# Altium schematic sheet IMU.SchDoc
size A4
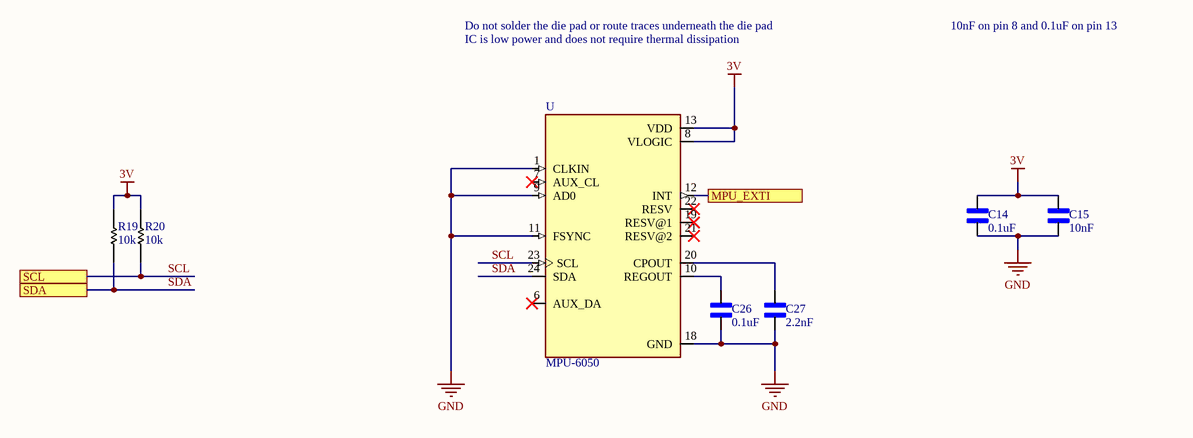
[diagram p0: IMU.SchDoc]

## Parts
C14  0.1uF  [0402 Capacitor Generic]
C15  10nF  [0402 Capacitor Generic]
C26  0.1uF  [0402 Capacitor Generic]
C27  2.2nF  [0402 Capacitor Generic]
R19  10k  [0402 Resistor Generic]
R20  10k  [0402 Resistor Generic]
U  MPU-6050  [MPU-6050]

## Ports
MPU_EXTI, SCL, SDA

## Nets
3V: C14.1 C15.1 R19.1 R20.1 U.8(VLOGIC) U.13(VDD)
GND: C14.2 C15.2 C26.2 C27.2 U.1(CLKIN) U.9(AD0) U.11(FSYNC) U.18(GND)
MPU_EXTI: U.12(INT) ; port MPU_EXTI
SCL: R20.2 U.23(SCL) ; port SCL
SDA: R19.2 U.24(SDA) ; port SDA
NetC26_1: C26.1 U.10(REGOUT)
NetC27_1: C27.1 U.20(CPOUT)

Not connected (* = marked no-connect by the designer): U 6(AUX_DA)* 7(AUX_CL)* 19(RESV@1)* 21(RESV@2)* 22(RESV)*

## Notes on the sheet
- Do not solder the die pad or route traces underneath the die pad
- IC is low power and does not require thermal dissipation
- 10nF on pin 8 and 0.1uF on pin 13

## Library data of the parts
C14 C15 C26 C27 = 0402 Ceramic Capacitor: Generic 0402 Ceramic Capacitor; MP: AC0402FR-071ML; MF: Yageo; Package: 1005 Yageo; SnapEDA_Link: https://www.snapeda.com/parts/AC0402FR-071ML/Yageo/view-part/940461/?ref=snap; Value: *; Mouser-Purchase-URL: https://snapeda.com/shop?store=Mouser&id=940461; DigiKey-Purchase-URL: https://snapeda.com/shop?store=DigiKey&id=940461
R19 R20 = 0402 Generic Resistor: Generic 0402 Resistor
U = MPU-6050: Accelerometer, Gyroscope, 6 Axis Sensor IÂ²C Output; MF: TDK InvenSense; Price: None; Package: VFQFN-24 TDK InvenSense; MP: MPU-6050; Value: *; Availability: Unavailable; SnapEDA_Link: https://www.snapeda.com/parts/MPU-6050/TDK%20InvenSense/view-part/4503180/?ref=snap